# EAGLE design trx-mainboard (EAGLE 9.6.2)

## Sheet 1 of 2: Logic
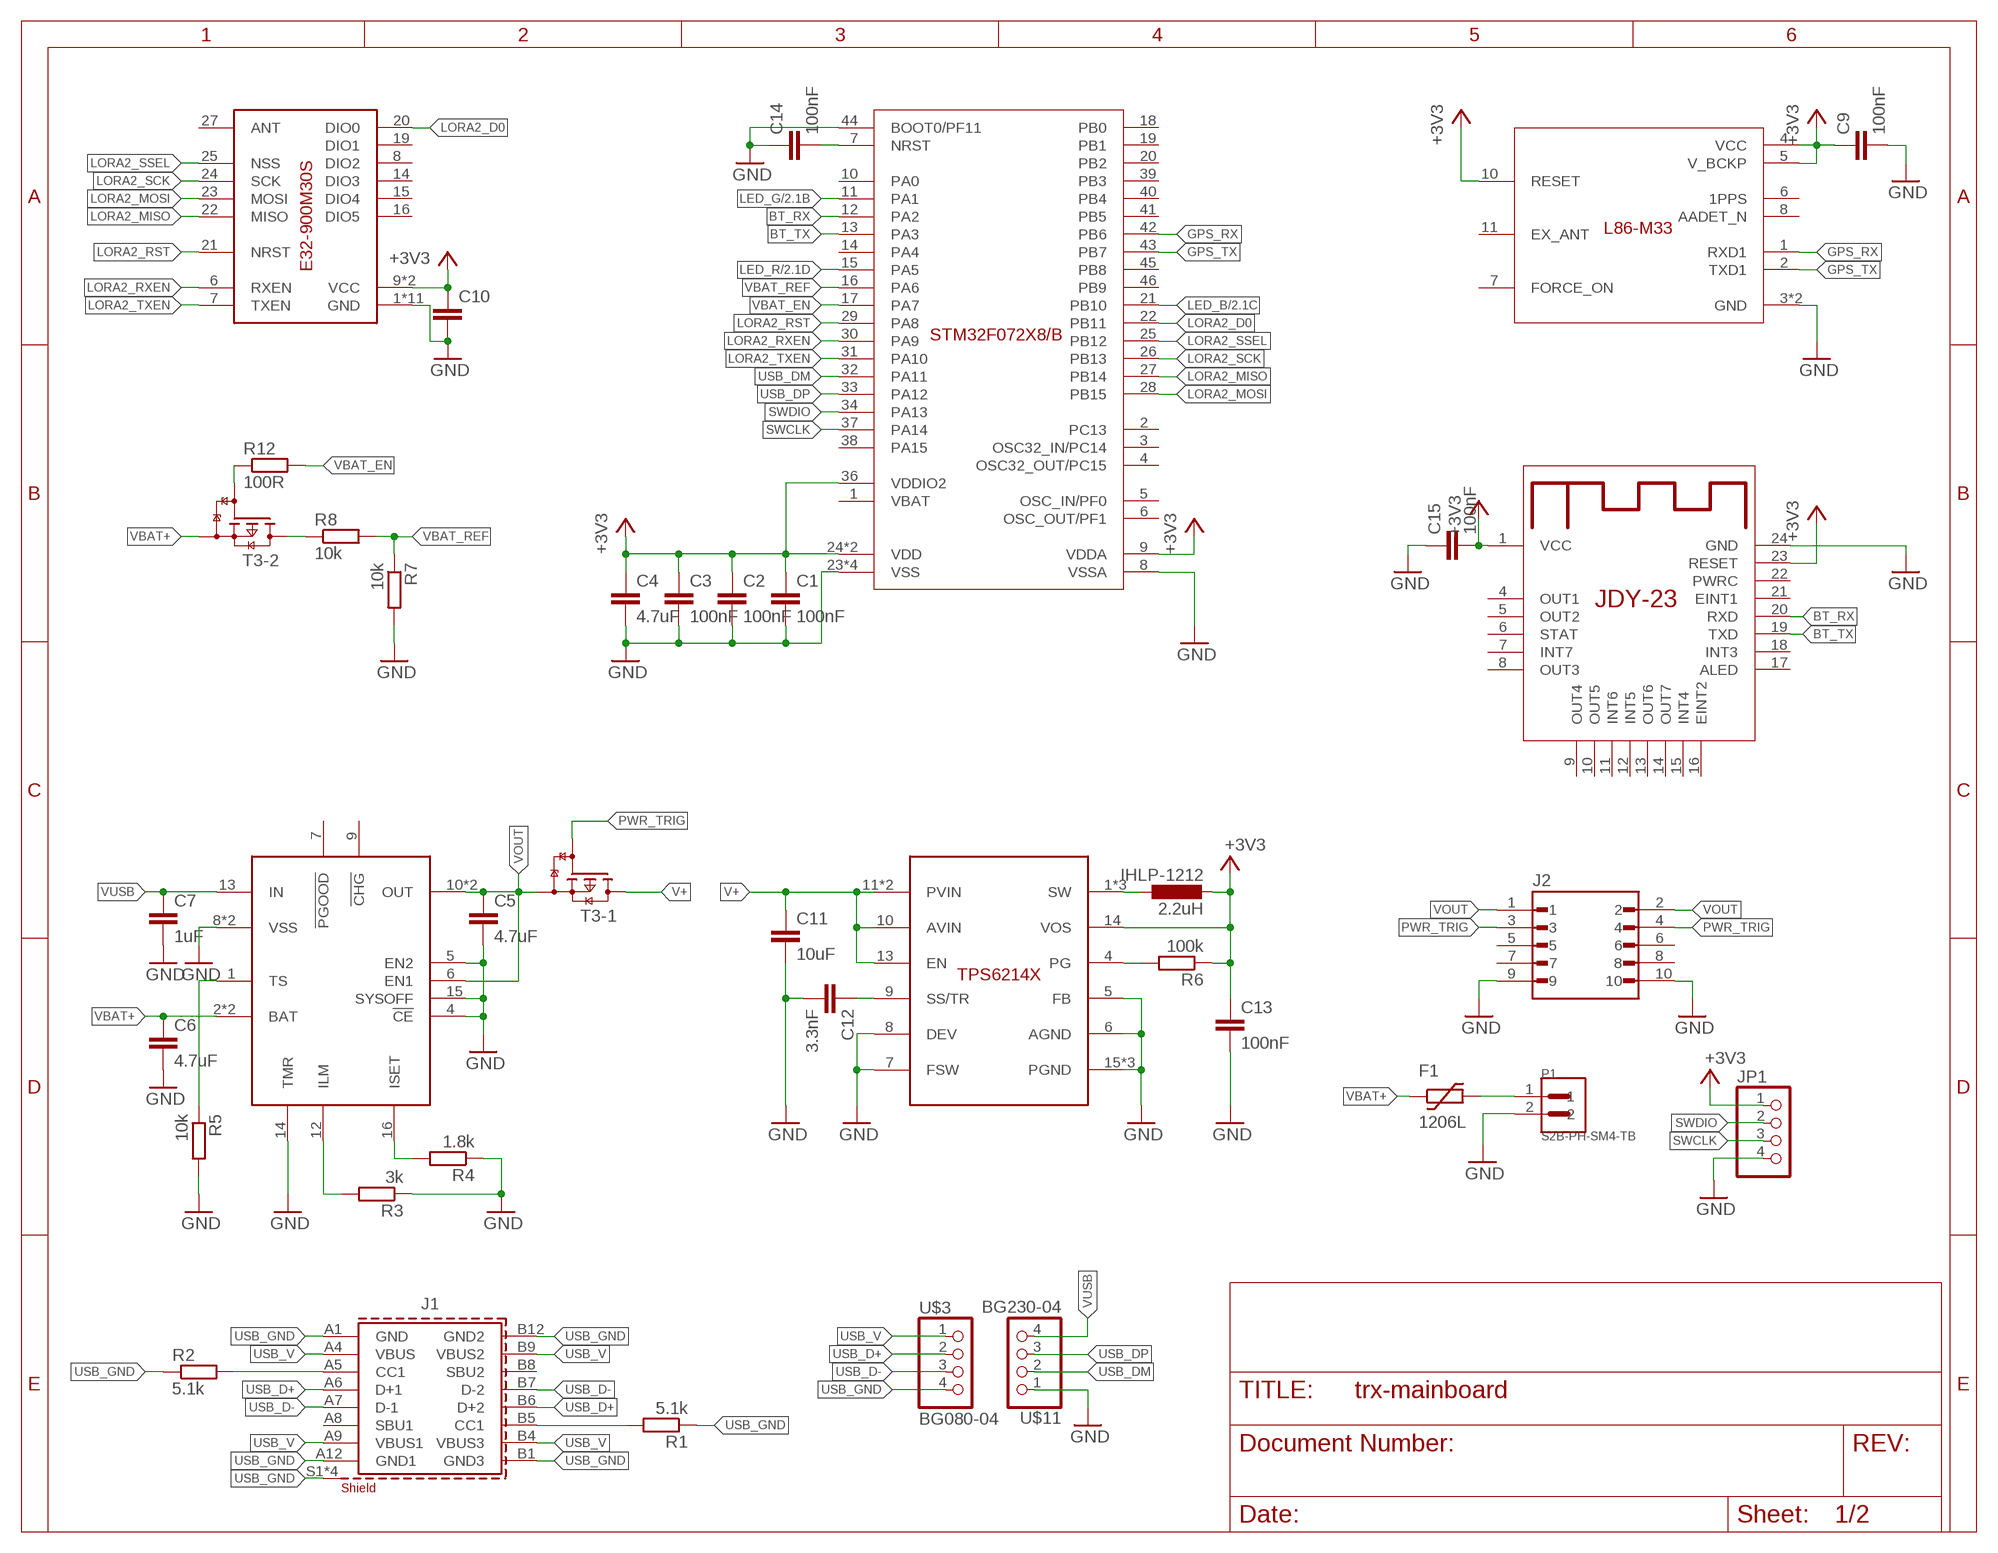
[diagram p0: schematic, sheet 1]

### Parts
C1  100nF  C-EUC0805  [C0805]
C2  100nF  C-EUC0805  [C0805]
C3  100nF  C-EUC0805  [C0805]
C4  4.7uF  C-EUC0805  [C0805]
C5  4.7uF  C-EUC0805  [C0805]
C6  4.7uF  C-EUC0805  [C0805]
C7  1uF  C-EUC0805  [C0805]
C9  100nF  C-EUC0805  [C0805]
C10  4.7uF  C-EUC0805  [C0805]
C11  10uF  C-EUC0805  [C0805]
C12  3.3nF  C-EUC0805  [C0805]
C13  100nF  C-EUC0805  [C0805]
C14  100nF  C-EUC0805  [C0805]
C15  100nF  C-EUC0805  [C0805]
F1  1206L  [1206L]
J1  629722000214  [629722000214]
J2  DF12NB(3.0)-10DP-0.5V  [HRS_DF12NB(3.0)-10DP-0.5V]
JP1  PINHD-1X04_2.54-SMD  [1X04SMD]
P1  S2B-PH-SM4-TB  [JST_S2B-PH-SM4-TB]
R1  5.1k  R-EU_R0805  [R0805]
R2  5.1k  R-EU_R0805  [R0805]
R3  3k  R-EU_R0805  [R0805]
R4  1.8k  R-EU_R0805  [R0805]
R5  10k  R-EU_R0805  [R0805]
R6  100k  R-EU_R0805  [R0805]
R7  10k  R-EU_R0805  [R0805]
R8  10k  R-EU_R0805  [R0805]
R12  100R  R-EU_R0805  [R0805]
T3  NX3008PBKS  [SOT363]
U2  BQ2407X  [VQFN16-3X3]
U$1  L86-M33  [L86-M33]
U$2  TPS6214X  [VQFN16-3X3]
U$3  BG080-04  [P-1X4/90-2.54X1.50MMX2.54MM-SMT]
U$4  IHLP-1212  [1212BZ]
U$5  JDY-23  [JDY-23]
U$10  STM32-F072X8/B-48  [UFQFPN48-7X7]
U$11  BG230-04  [S-1X4/90-2.54MM-SMT]
U$14  E32-900M30S  [E32-900M30S]

### Nets
+3V3: C1.1 C2.1 C3.1 C4.1 C9.1 C10.1 C13.1 C15.2 JP1.1 R6.1 U$1.4(VCC) U$1.5(V_BCKP) U$1.10(RESET) U$2.14(VOS) U$4.2 U$5.1(VCC) U$5.23(RESET) U$10.9(VDDA) U$10.24(VDD) U$10.36(VDDIO2) U$10.48(VDD) U$14.9(VCC) U$14.10(VCC) ; also sheet 2
BT_RX: U$5.20(RXD) U$10.12(PA2)
BT_TX: U$5.19(TXD) U$10.13(PA3)
GND: C1.2 C2.2 C3.2 C4.2 C5.2 C6.2 C7.2 C9.2 C10.2 C11.2 C12.2 C13.2 C14.1 C15.1 J2.9 J2.10 JP1.4 P1.2 R3.1 R4.1 R5.2 R7.2 U2.4(!CE) U2.5(EN2) U2.8(VSS) U2.14(TMR) U2.15(SYSOFF) U2.17(VSS) U$1.3(GND) U$1.12(GND) U$2.5(FB) U$2.6(AGND) U$2.7(FSW) U$2.8(DEV) U$2.15(PGND) U$2.16(PGND) U$2.17(PGND) U$5.24(GND) U$10.8(VSSA) U$10.23(VSS) U$10.35(VSS) U$10.44(BOOT0/PF11) U$10.47(VSS) U$10.P$49(VSS) U$11.1 U$14.1(GND) U$14.2(GND) U$14.3(GND) U$14.4(GND) U$14.5(GND) U$14.11(GND) U$14.12(GND) U$14.17(GND) U$14.18(GND) U$14.26(GND) U$14.28(GND) ; also sheet 2
GPS_RX: U$1.1(RXD1) U$10.42(PB6)
GPS_TX: U$1.2(TXD1) U$10.43(PB7)
LED_B: U$10.21(PB10) ; also sheet 2
LED_G: U$10.11(PA1) ; also sheet 2
LED_R: U$10.15(PA5) ; also sheet 2
LORA2_D0: U$10.22(PB11) U$14.20(DIO0)
LORA2_MISO: U$10.27(PB14) U$14.22(MISO)
LORA2_MOSI: U$10.28(PB15) U$14.23(MOSI)
LORA2_RST: U$10.29(PA8) U$14.21(NRST)
LORA2_RXEN: U$10.30(PA9) U$14.6(RXEN)
LORA2_SCK: U$10.26(PB13) U$14.24(SCK)
LORA2_SSEL: U$10.25(PB12) U$14.25(NSS)
LORA2_TXEN: U$10.31(PA10) U$14.7(TXEN)
N$1: J1.A5(CC1) R2.2
N$2: J1.B5(CC1) R1.2
N$3: R3.2 U2.12(ILM)
N$4: R4.2 U2.16(ISET)
N$5: R5.1 U2.1(TS)
N$6: U$2.1(SW) U$2.2(SW) U$2.3(SW) U$4.1
N$7: C12.1 U$2.9(SS/TR)
N$8: R6.2 U$2.4(PG)
N$11: C14.2 U$10.7(NRST)
N$12: F1.P$2 P1.1
N$14: R8.1 T3.3(-2:D)
N$17: R12.1 T3.5(-2:G)
PWR_TRIG: J2.3 J2.4 T3.2(-1:G)
SWCLK: JP1.3 U$10.37(PA14)
SWDIO: JP1.2 U$10.34(PA13)
USB_D+: J1.A6(D+1) J1.B6(D+2) U$3.2
USB_D-: J1.A7(D-1) J1.B7(D-2) U$3.3
USB_DM: U$10.32(PA11) U$11.2
USB_DP: U$10.33(PA12) U$11.3
USB_GND: J1.A1(GND) J1.A12(GND1) J1.B1(GND3) J1.B12(GND2) J1.S1(SHIELD) J1.S2(SHIELD) J1.S3(SHIELD) J1.S4(SHIELD) R1.1 R2.1 U$3.4
USB_V: J1.A4(VBUS) J1.A9(VBUS1) J1.B4(VBUS3) J1.B9(VBUS2) U$3.1
V+: C11.1 T3.6(-1:D) U$2.10(AVIN) U$2.11(PVIN) U$2.12(PVIN) U$2.13(EN)
VBAT+: C6.1 F1.P$1 T3.4(-2:S) U2.2(BAT) U2.3(BAT)
VBAT_EN: R12.2 U$10.17(PA7)
VBAT_REF: R7.1 R8.2 U$10.16(PA6)
VOUT: C5.1 J2.1 J2.2 T3.1(-1:S) U2.6(EN1) U2.10(OUT) U2.11(OUT)
VUSB: C7.1 U2.13(IN) U$11.4
Unconnected: J1.A8(SBU1) J1.B8(SBU2) J2.5 J2.6 J2.7 J2.8 U2.7(!PGOOD) U2.9(!CHG) U$1.6(1PPS) U$1.7(FORCE_ON) U$1.8(AADET_N) U$1.11(EX_ANT) U$5.4(OUT1) U$5.5(OUT2) U$5.6(STAT) U$5.7(INT7) U$5.8(OUT3) U$5.9(OUT4) U$5.10(OUT5) U$5.11(INT6) U$5.12(INT5) U$5.13(OUT6) U$5.14(OUT7) U$5.15(INT4) U$5.16(EINT2) U$5.17(ALED) U$5.18(INT3) U$5.21(EINT1) U$5.22(PWRC) U$10.1(VBAT) U$10.2(PC13) U$10.3(OSC32_IN/PC14) U$10.4(OSC32_OUT/PC15) U$10.5(OSC_IN/PF0) U$10.6(OSC_OUT/PF1) U$10.10(PA0) U$10.14(PA4) U$10.18(PB0) U$10.19(PB1) U$10.20(PB2) U$10.38(PA15) U$10.39(PB3) U$10.40(PB4) U$10.41(PB5) U$10.45(PB8) U$10.46(PB9) U$14.8(DIO2) U$14.14(DIO3) U$14.15(DIO4) U$14.16(DIO5) U$14.19(DIO1) U$14.27(ANT)

### Notes on the sheet
- 2.2uH

## Sheet 2 of 2
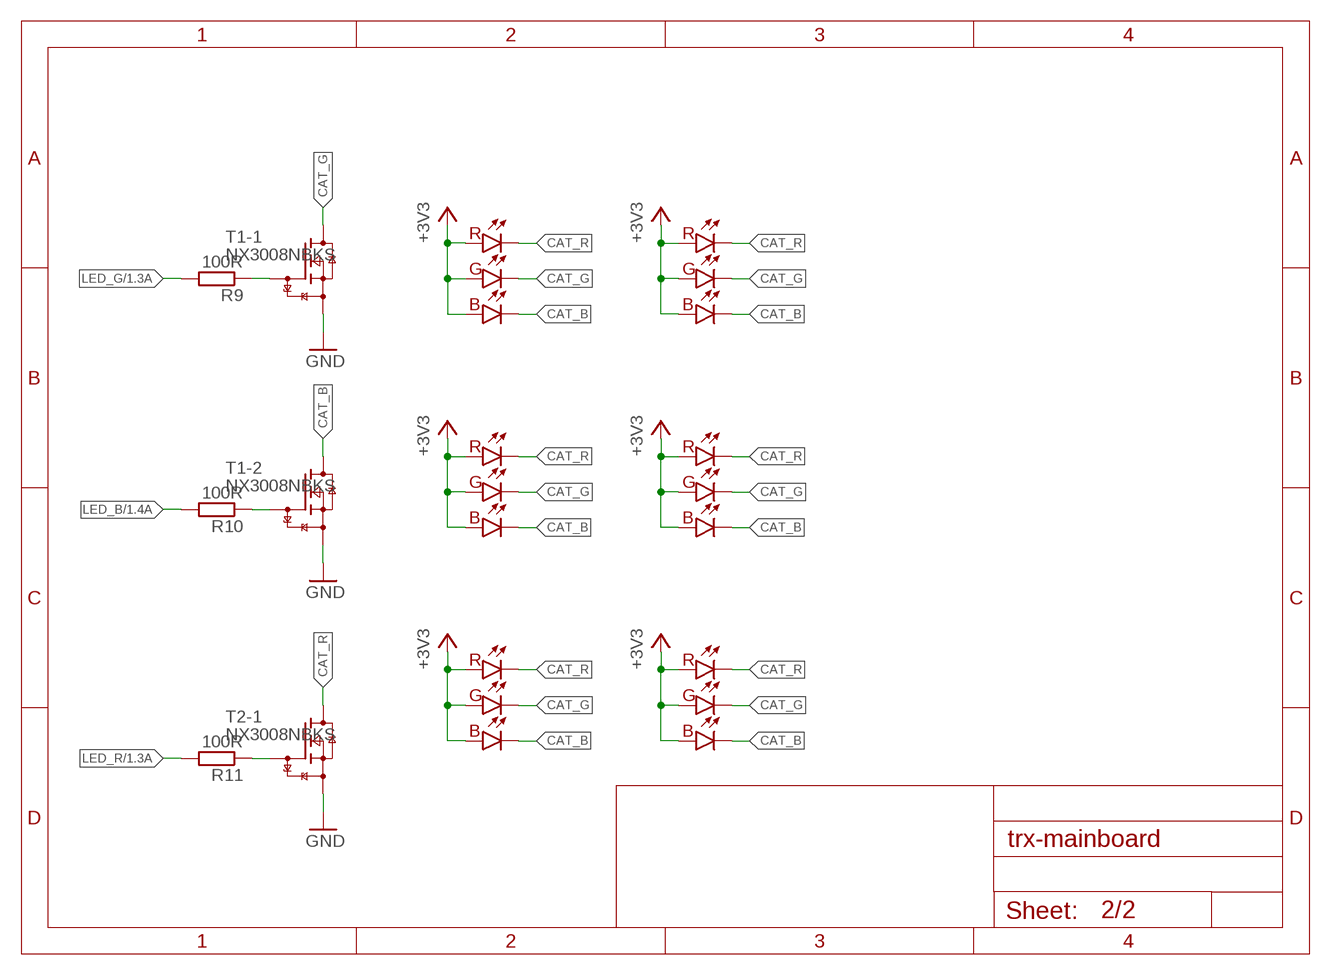
[diagram p1: schematic, sheet 2]

### Parts
R9  100R  R-EU_R0805  [R0805]
R10  100R  R-EU_R0805  [R0805]
R11  100R  R-EU_R0805  [R0805]
T1  NX3008NBKS  [SOT363]
T2  NX3008NBKS  [SOT363]
U$6  RGB_LED  [PLCC6]
U$7  RGB_LED  [PLCC6]
U$8  RGB_LED  [PLCC6]
U$9  RGB_LED  [PLCC6]
U$12  RGB_LED  [PLCC6]
U$13  RGB_LED  [PLCC6]

### Nets
+3V3: U$6.1(A.B) U$6.3(A.R) U$6.5(A.G) U$7.1(A.B) U$7.3(A.R) U$7.5(A.G) U$8.1(A.B) U$8.3(A.R) U$8.5(A.G) U$9.1(A.B) U$9.3(A.R) U$9.5(A.G) U$12.1(A.B) U$12.3(A.R) U$12.5(A.G) U$13.1(A.B) U$13.3(A.R) U$13.5(A.G) ; also sheet 1
CAT_B: T1.3(-2:D) U$6.2(C.B) U$7.2(C.B) U$8.2(C.B) U$9.2(C.B) U$12.2(C.B) U$13.2(C.B)
CAT_G: T1.6(-1:D) U$6.6(C.G) U$7.6(C.G) U$8.6(C.G) U$9.6(C.G) U$12.6(C.G) U$13.6(C.G)
CAT_R: T2.6(-1:D) U$6.4(C.R) U$7.4(C.R) U$8.4(C.R) U$9.4(C.R) U$12.4(C.R) U$13.4(C.R)
GND: T1.1(-1:S) T1.4(-2:S) T2.1(-1:S) ; also sheet 1
LED_B: R10.2 ; also sheet 1
LED_G: R9.2 ; also sheet 1
LED_R: R11.2 ; also sheet 1
N$13: R9.1 T1.2(-1:G)
N$16: R10.1 T1.5(-2:G)
N$18: R11.1 T2.2(-1:G)
Unconnected: T2.3(-2:D) T2.4(-2:S) T2.5(-2:G)

## Library data of the parts
C1-C7 C9-C15 = rcl:C-EU: CAPACITOR, European symbol; SPICEPREFIX: C
F1 = ptc-littlefuse:1206L
J1 = Wurth_Connectors_WR-USB:629722000214: WR-COM USB 2.0 Type C Plug Vertical SMT Kind Properties Durability 10 000 Mating cycles Gender Receptacle Type Horizontal General Information Operating Temperature -40 up to +85 °C Electrical Properties Working Voltage 20 V (DC) Withstanding Voltage 100 V (AC) Contact Resistance 40 mΩ Material Properties Insulator Material LCP Insulator Flammability Rating UL94 V-0 Insulator Color Black Contact Material Brass Contact Plating Gold over Nickel Contact Type Stamped Shielding Material Steel Shielding Plating Nickel (Ni) <https://www.we-online.com/catalog/media/o689297v209%20family-wr-com-629722000214.jpg> Details see: www.we-online.com/catalog/WR-COM_USB_20_TYPE_C_RECEPTACLE_HORIZONTAL_SMT Updated by Ella Wu 2022-05-09 2022 (C) Würth Elektronik; APPLICATION: USB 2.0; DATASHEET-URL: https://www.we-online.com/redexpert/spec/629722000214?ae; GERDER: Receptacle; INTERFACE-TYPE: Type C; IR: 5A; MOUNT: SMT; PACKAGING: Tape and Reel; PART-NUMBER: 629722000214; PINS: 16; TYPE: Horizontal; WORKING-VOLTAGE: 20V(AC)
J2 = con-hirose2:DF12NB(3.0)-10DP-0.5V: Check availability <https://pricing.snapeda.com/parts/DF12NB%283.0%29-10DP-0.5V%2851%29/Hirose/view-part?ref=eda>; AVAILABILITY: In Stock; DESCRIPTION: 10 Position Connector Header, Outer Shroud Contacts Surface Mount Gold; MF: Hirose; MP: DF12NB(3.0)-10DP-0.5V(51); PACKAGE: None; PRICE: None; PURCHASE-URL: https://pricing.snapeda.com/search?q=DF12NB(3.0)-10DP-0.5V(51)&ref=eda
JP1 = pinhead2:PINHD-1X04: PIN HEADER
P1 = con-jst2:S2B-PH-SM4-TB: CONN HEADER PH SIDE 2POS 2MM SMD Check availability <https://pricing.snapeda.com/parts/S2B-PH-SM4-TB/JST%20Sales/view-part?ref=eda>; AVAILABILITY: In Stock; DESCRIPTION: Connector Header Surface Mount, Right Angle 2 position 0.079 (2.00mm); MF: JST Sales; MP: S2B-PH-SM4-TB; PACKAGE: None; PRICE: None; PURCHASE-URL: https://pricing.snapeda.com/search?q=S2B-PH-SM4-TB&ref=eda
R1-R12 = rcl:R-EU_: RESISTOR, European symbol; SPICEPREFIX: R
T1 T2 = NXP_60_26022015:NX3008NBKS: 30 V, 350 mA dual N-channel Trench MOSFET Dual N-channel enhancement mode Field-Effect Transistor (FET) in a very small SOT363 (SC-88) Surface-Mounted Device (SMD) plastic package using Trench MOSFET technology. AAL Eindhoven MK
T3 = NXP_60_26022015:NX3008PBKS: 30 V, 200 mA dual P-channel Trench MOSFET Dual P-channel enhancement mode Field-Effect Transistor (FET) in a very small SOT363 (SC-88) Surface-Mounted Device (SMD) plastic package using Trench MOSFET technology. AAL Eindhoven MK
U2 = texas-instruments:BQ2407X
U$1 = quectel:L86-M33
U$2 = texas-instruments:TPS6214X
U$3 = con-gct:BG080-04
U$4 = inductor-vishay:IHLP-1212
U$5 = bluetooth:JDY-23
U$6-U$9 U$12 U$13 = led:RGB_LED
U$10 = st-microelectronics:STM32-F072X8/B-48
U$11 = con-gct:BG230-04
U$14 = ebyte:E32-900M30S

## Board
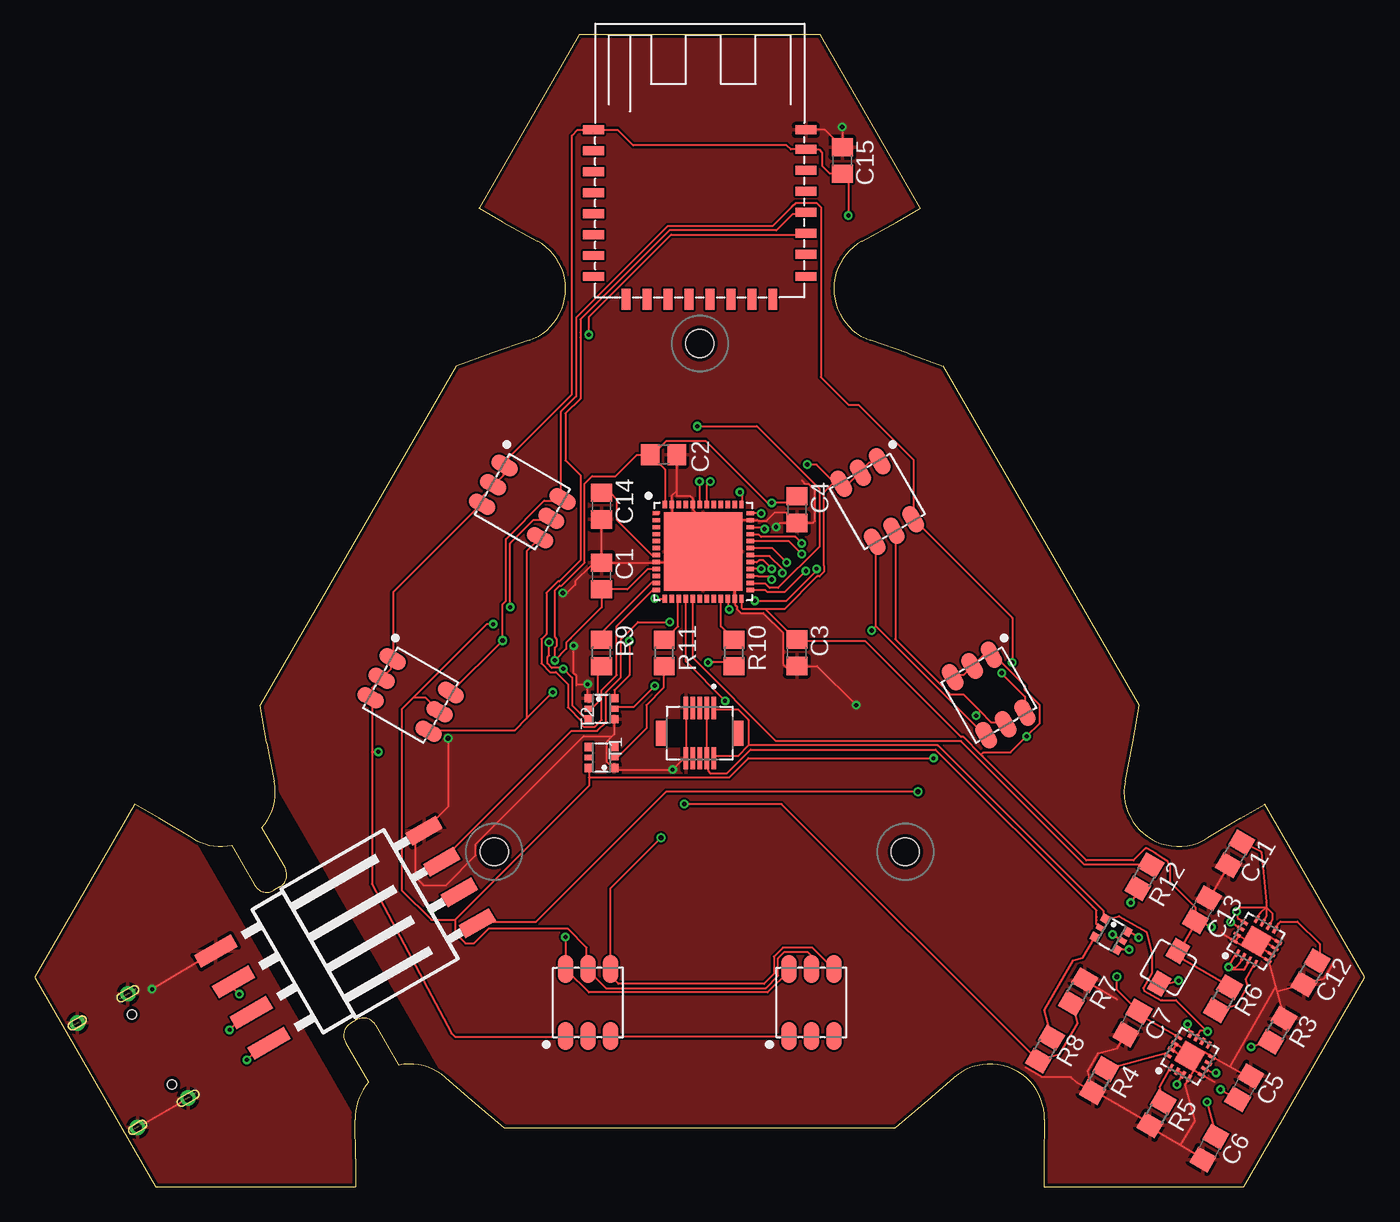
[diagram p2: board, top side]
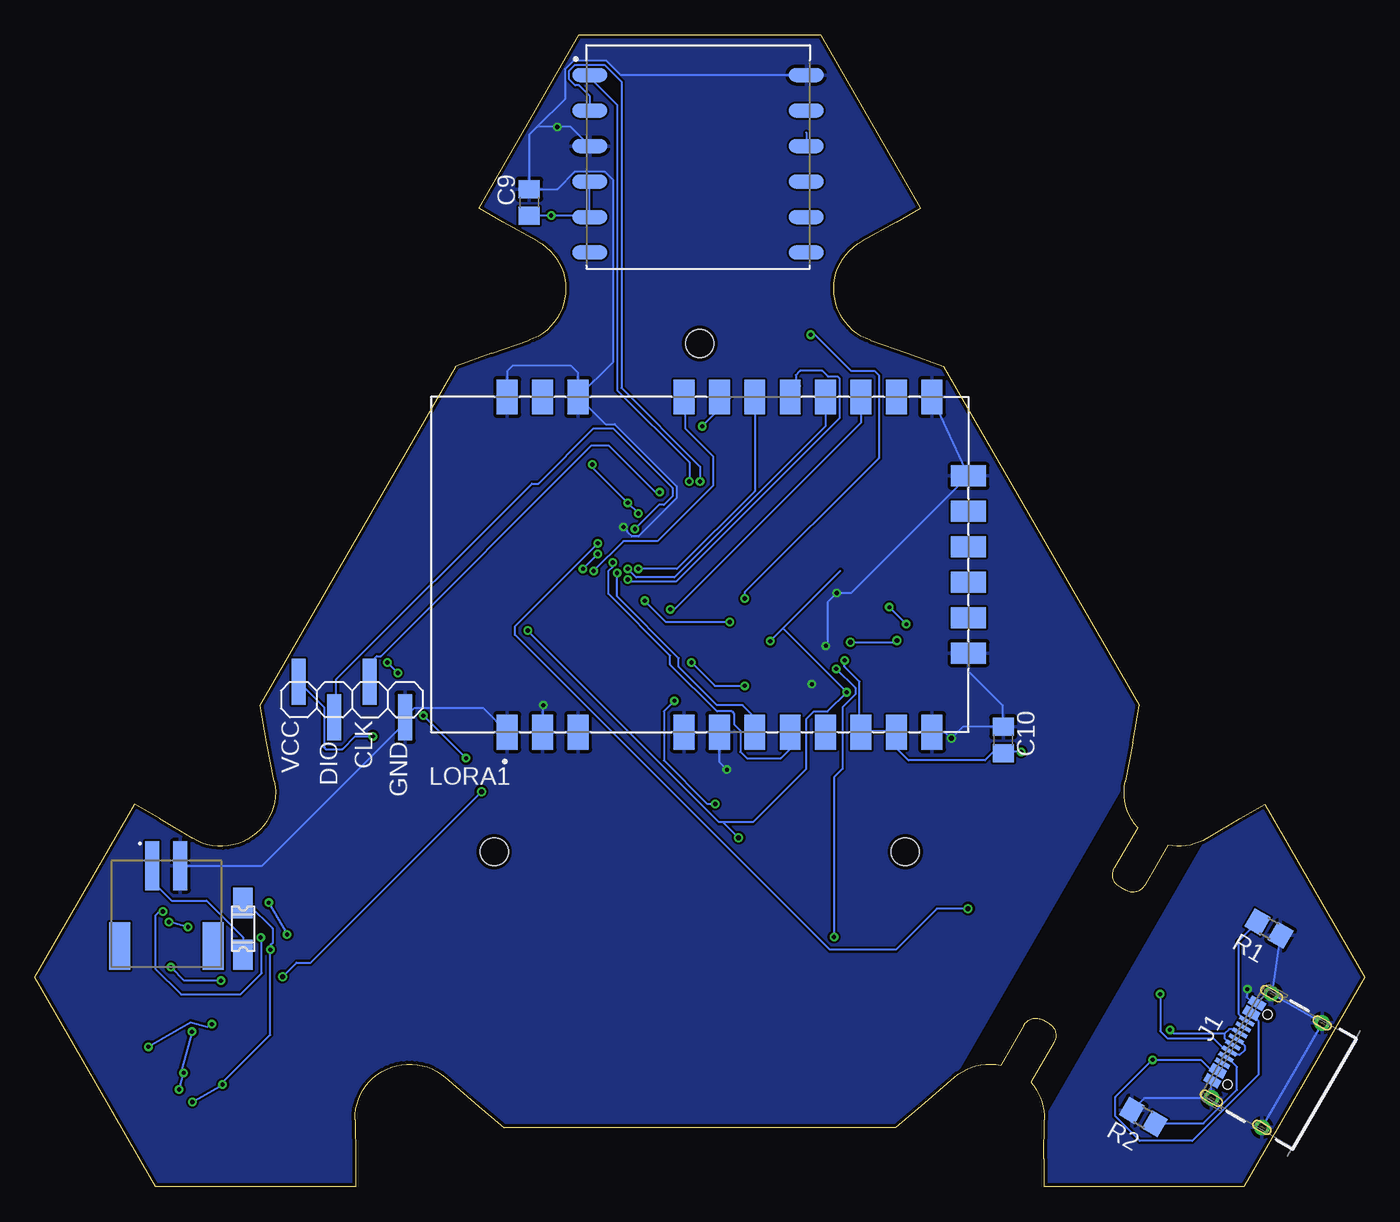
[diagram p3: board, bottom side, seen from below]

Size 95.26 x 82.5 mm. Coordinates in mm from the lower left corner, seen from the top.
Outline: 11.31,24.95 8.9,26.41 7.17,27.41 0,15 8.66,0 22.99,0 22.99,2 22.93,4.82 arc-43 23.91,7.48 22.25,10.34 arc-90 22.62,11.7 23.05,11.95 arc-90 24.42,11.59 26.07,8.72 arc-52 29.4,7.84 31.52,5.98 33.6,4.24 61.66,4.24 63.74,5.98 65.86,7.84 arc-132 72.33,4.82 72.27,2 72.27,0 86.6,0 95.26,15 88.1,27.41 86.36,26.41 83.95,24.95 arc-132 78.11,29.04 78.65,31.81 79.12,34.48 65.09,58.78 62.54,59.71 59.87,60.62 arc-132 59.25,67.73 61.73,69.09 63.46,70.09 56.29,82.5 38.97,82.5 31.81,70.09 33.54,69.09 36.01,67.73 arc-132 35.39,60.62 32.72,59.71 30.18,58.78 16.14,34.48 16.61,31.81 17.16,29.04 arc-52 16.26,25.71 17.91,22.85 arc-90 17.55,21.48 17.12,21.24 arc-90 15.75,21.6 14.1,24.46 arc-43 11.31,24.95
Copper layers (1*16): Top 0.035mm / dielectric 1.5mm / Bottom 0.035mm
Design rules "seeed-studio-2-layer (1)": minimum track width 6mil, minimum drill 12mil, track to track 6mil, track to pad 6mil, pad to pad 6mil, via to via 6mil, smd to smd 0mil, copper to edge 10mil, drill to drill 10mil, minimum pad ring 10mil, minimum via ring 6mil, stop-mask expansion 2mil, vias tented up to drill 100mil, thermal gap 10mil
Holes 2 mm at 32.91,24 62.35,24 47.63,60.4

### Footprints (pad centres in the part's own frame; a part is rotated, then mirrored left to right if it is on the bottom)
C0805 = smd 1.3 x 1.5: 1 -0.95,0; 2 0.95,0
1206L = smd 2.16 x 1.4: P$1 -1.85,0; P$2 1.85,0
629722000214 = smd 0.3 x 1.15: A1 -3.35,4.745; A4 -2.55,4.745; A5 -1.25,4.745; A6 -0.25,4.745; A7 0.25,4.745; A8 1.25,4.745; A9 2.55,4.745; A12 3.35,4.745; B1 3.05,4.745; B4 2.25,4.745; B5 1.75,4.745; B6 0.75,4.745; B7 -0.75,4.745; B8 -1.75,4.745; B9 -2.25,4.745; B12 -3.05,4.745 | drill 0.6 pad 1: S1 -4.32,4.18; S2 4.32,4.18; S3 -4.32,0; S4 4.32,0 | hole 0.65: -2.89,3.68; 2.89,3.68
HRS_DF12NB(3.0)-10DP-0.5V = smd 0.3 x 1.6: 1 -1,-1.8; 2 -1,1.8; 3 -0.5,-1.8; 4 -0.5,1.8; 5 0,-1.8; 6 0,1.8; 7 0.5,-1.8; 8 0.5,1.8; 9 1,-1.8; 10 1,1.8 | smd 0.8 x 1.8: S1 -2.75,0; S2 2.75,0
1X04SMD = smd 1.016 x 3.302: 1 -1.27,1.27; 2 1.27,-1.27; 3 3.81,1.27; 4 6.35,-1.27
JST_S2B-PH-SM4-TB = smd 1 x 3.5: 1 1,0; 2 -1,0 | smd 1.5 x 3.4: P1 3.35,5.75; P2 -3.35,5.75
R0805 = smd 1.3 x 1.5: 1 -0.95,0; 2 0.95,0
SOT363 = smd 0.6 x 0.6: 1 -0.75,-0.9; 3 0.75,-0.9; 4 0.75,0.9; 6 -0.75,0.9 | smd 0.4 x 0.6: 2 0,-0.9; 5 0,0.9
VQFN16-3X3 = smd 0.5 x 0.14: 1 -1.4,0.75; 2 -1.4,0.25; 3 -1.4,-0.25; 4 -1.4,-0.75; 9 1.4,-0.75; 10 1.4,-0.25; 11 1.4,0.25; 12 1.4,0.75 | smd 0.14 x 0.5: 5 -0.75,-1.4; 6 -0.25,-1.4; 7 0.25,-1.4; 8 0.75,-1.4; 13 0.75,1.4; 14 0.25,1.4; 15 -0.25,1.4; 16 -0.75,1.4 | smd 1.58 x 1.58: 17 0,0
L86-M33 = smd 2.5 x 1: 1 -7.75,6.35; 2 -7.75,3.81; 3 -7.75,1.27; 4 -7.75,-1.27; 5 -7.75,-3.81; 6 -7.75,-6.35; 7 7.75,-6.35; 8 7.75,-3.81; 9 7.75,-1.27; 10 7.75,1.27; 11 7.75,3.81; 12 7.75,6.35
P-1X4/90-2.54X1.50MMX2.54MM-SMT = smd 1.02 x 3: 1 -3.81,5; 2 -1.27,5; 3 1.27,5; 4 3.81,5
1212BZ = smd 1.5 x 1.2: 1 -1.35,0; 2 1.35,0
JDY-23 = smd 0.635 x 1.5: 1 2.2,7.6; 2 0.7,7.6; 3 -0.8,7.6; 4 -2.3,7.6; 5 -3.8,7.6; 6 -5.3,7.6; 7 -6.8,7.6; 8 -8.3,7.6; 17 -8.3,-7.6; 18 -6.7,-7.6; 19 -5.2,-7.6; 20 -3.7,-7.6; 21 -2.2,-7.6; 22 -0.7,-7.6; 23 0.8,-7.6; 24 2.2,-7.6 | smd 1.5 x 0.635: 9 -9.93,5.27; 10 -9.93,3.77; 11 -9.93,2.27; 12 -9.93,0.77; 13 -9.93,-0.73; 14 -9.93,-2.23; 15 -9.93,-3.73; 16 -9.93,-5.23
PLCC6 = smd 2 x 1.1: 1 -2.4,1.6; 2 2.4,1.6; 3 -2.4,0; 4 2.4,0; 5 -2.4,-1.6; 6 2.4,-1.6
UFQFPN48-7X7 = smd 0.4 x 0.2: 1 -3.375,2.75 | smd 0.55 x 0.3: 2 -3.375,2.25; 3 -3.375,1.75; 4 -3.375,1.25; 5 -3.375,0.75; 6 -3.375,0.25; 7 -3.375,-0.25; 8 -3.375,-0.75; 9 -3.375,-1.25; 10 -3.375,-1.75; 11 -3.375,-2.25; 12 -3.375,-2.75; 25 3.375,-2.75; 26 3.375,-2.25; 27 3.375,-1.75; 28 3.375,-1.25; 29 3.375,-0.75; 30 3.375,-0.25; 31 3.375,0.25; 32 3.375,0.75; 33 3.375,1.25; 34 3.375,1.75; 35 3.375,2.25; 36 3.375,2.75 | smd 0.3 x 0.55: 13 -2.75,-3.375; 14 -2.25,-3.375; 15 -1.75,-3.375; 16 -1.25,-3.375; 17 -0.75,-3.375; 18 -0.25,-3.375; 19 0.25,-3.375; 20 0.75,-3.375; 21 1.25,-3.375; 22 1.75,-3.375; 23 2.25,-3.375; 24 2.75,-3.375; 37 2.75,3.375; 38 2.25,3.375; 39 1.75,3.375; 40 1.25,3.375; 41 0.75,3.375; 42 0.25,3.375; 43 -0.25,3.375; 44 -0.75,3.375; 45 -1.25,3.375; 46 -1.75,3.375; 47 -2.25,3.375; 48 -2.75,3.375 | smd 5.6 x 5.6: P$49 0,0
S-1X4/90-2.54MM-SMT = smd 1.04 x 2.5: 1 -3.81,2.45; 2 -1.27,2.45; 3 1.27,2.45; 4 3.81,2.45
E32-900M30S = smd 2.5 x 1.5: 1 12,-13.79; 2 12,-11.25; 3 12,-8.71; 4 12,-1.14; 5 12,1.4; 6 12,3.94; 7 12,6.48; 8 12,9.02; 9 12,11.56; 10 12,14.1; 11 12,16.64; 18 -12,16.64; 19 -12,14.1; 20 -12,11.56; 21 -12,9.02; 22 -12,6.48; 23 -12,3.94; 24 -12,1.4; 25 -12,-1.14; 26 -12,-8.71; 27 -12,-11.25; 28 -12,-13.79 | smd 1.5 x 2.5: 12 6.35,19.254; 13 3.81,19.254; 14 1.27,19.254; 15 -1.27,19.254; 16 -3.81,19.254; 17 -6.35,19.254

### Placement (x,y rotation side)
C1  40.6,43.75 90 top
C2  45.04,52.44 0 top
C3  54.59,38.25 270 top
C4  54.6,48.5 270 top
C5  86.64,7.11 60 top
C6  84.14,2.78 240 top
C7  78.63,11.73 240 top
C9  59.85,70.5 90 bottom
C10  25.88,32 90 bottom
C11  85.99,23.86 240 top
C12  91.39,15.33 240 top
C13  83.6,19.84 60 top
C14  40.6,48.75 90 top
C15  57.85,73.5 270 top
F1  80.35,18.48 270 bottom
J1  5.2,8 60 bottom
J2  47.63,32.5 180 top
JP1  75.09,34.9 0 bottom
P1  85.85,23 180 bottom
R1  6.85,18.5 150 bottom
R2  15.85,5 330 bottom
R3  89.01,11.22 240 top
R4  76.25,7.62 60 top
R5  80.37,5.24 240 top
R6  85.12,13.47 240 top
R7  74.73,13.98 60 top
R8  72.36,9.86 240 top
R9  40.59,38.24 90 top
R10  50.09,38.24 90 top
R11  45.09,38.24 90 top
R12  79.48,22.21 60 top
T1  40.6,34.24 270 top
T2  40.6,30.74 90 top
T3  77.11,18.09 240 top
U2  82.74,9.36 60 top
U$1  47.75,73.27 0 bottom
U$2  87.49,17.58 60 top
U$3  19.2,16.09 120 top
U$4  81.22,15.72 60 top
U$5  47.63,73.5 90 top
U$6  26.92,35.22 330 top
U$7  34.92,49.08 330 top
U$8  39.63,13.2 90 top
U$9  55.63,13.2 90 top
U$10  47.88,45.5 0 top
U$11  27.66,20.97 300 top
U$12  60.35,49.08 300 top
U$13  68.35,35.22 300 top
U$14  47.63,44.57 270 bottom

### Tracks (layer width: path | path; a pad name or v marks a point on that pad's centre or on a via)
+3V3  (via drill 0.3)  (1 unrouted)
  Top 0.152: v85.65,18.97 86.41,18.53 U$2.14 | v84.29,18.61 83.42,19.11 83.25,19.06 C13.1 | C13.1 83.19,18.95 82,16.89 U$4.2 81.94,16.79 82.03,16.44 85.6,14.38 R6.1 | C13.1 83.12,19.12 83.12,20.03 81.29,21.86 81.29,23.08 81.17,23.2 81.13,23.37 80.84,23.53 80.31,23.89 79.67,24.25 79.57,24.25 78.71,23.38 75.32,23.38 67.88,30.82 67.88,30.85 67.79,30.94 | U$12.5 57.82,50.36 58.28,50.36 59.04,51.12 U$12.3 59.2,51.27 59.81,51.88 60.42,51.88 U$12.1 | v52.03,48.23 51.27,48.23 U$10.36 | C4.1 54.47,49.44 54.01,48.99 v52.8,48.99 52.49,48.99 48.06,53.42 45.24,53.42 44.26,52.44 C2.1 | 44.11,52.34 C2.1 | v55.33,51.73 56,51.73 57.37,50.36 57.67,50.36 U$12.5 | 50.66,41.98 U$10.24 50.63,41.46 50.7,41.4 52.31,41.4 52.33,41.38 | U$13.5 65.9,36.64 66.51,36.64 67.12,37.25 U$13.3 67.27,37.41 67.88,38.01 68.49,38.01 U$13.1 68.64,38.17 70.93,35.88 70.93,35.55 71.99,34.49 71.99,33.21 v71.05,32.27 69.9,31.12 67.96,31.12 67.79,30.94 | 67.79,30.94 66.51,32.22 66.36,32.22 59.5,39.08 54.62,39.08 C3.1 54.47,39.23 52.33,41.38 | 44.41,44.26 U$10.9 43.9,44.25 42.45,42.8 C1.1 40.6,41.5 38.38,39.28 38.37,39.28 38.06,38.97 38.06,38.52 v37.25,37.71 37.25,38.62 37.4,38.77 37.4,39.23 37.25,39.38 37.25,42.72 37.59,43.07 37.74,43.07 39.39,44.71 39.39,50.36 39.93,50.9 41.61,50.9 43.09,52.39 44.04,52.39 C2.1 | U$5.1 39.99,75.67 39.99,75.5 | v58.28,69.56 58.28,72.15 57.98,72.46 C15.2 57.82,72.61 56.92,72.61 56.4,73.14 56.4,74.06 56.16,74.3 U$5.23 54.15,74.3 53.86,74.59 42.86,74.59 41.75,75.7 U$5.1 | 38.16,10.73 39.54,10.73 U$8.3 39.69,10.73 41.21,10.73 U$8.5 41.37,10.73 54.01,10.73 U$9.1 54.17,10.73 55.54,10.73 U$9.3 55.69,10.73 57.21,10.73 U$9.5
  Top 0.152: 38.16,10.73 U$8.1 38.01,10.89 | 24.14,31.16 24.14,34.97 U$6.5 24.14,35.12 24.14,35.73 24.75,36.34 U$6.3 24.91,36.49 25.52,37.1 25.52,37.71 U$6.1 25.67,37.86 25.67,42.59 31.92,48.84 U$7.5 32.07,48.99 32.07,49.44 32.83,50.21 U$7.3 32.98,50.36 33.59,50.97 33.59,51.58 U$7.1 33.75,51.73 33.75,52.03 38.47,56.76 38.47,75.29 38.88,75.7 U$5.1 | 24.14,31.16 24.14,21.69 29.85,11 30.11,10.73 38.16,10.73 | 24.14,31.16 v24.6,31.16 | 43.96,52.34 C2.1 | C2.1 45.13,51.39 U$10.48 | 57.67,50.21 U$12.5 | U$12.5 57.15,50.36 56.5,49.7 56.5,44.52 56.53,44.48 56.53,44.04 56.22,43.73 56.05,43.73 53.7,41.38 52.33,41.38
  Bottom 0.152: v84.29,18.61 v85.65,18.97 | v52.03,48.23 v52.8,48.99 55.33,51.52 v55.33,51.73 | 76.26,36.28 JP1.1 74.56,34.37 74.56,31.48 74.42,31.35 73.22,31.35 72.3,32.27 v71.05,32.27 | v37.25,37.71 37.25,37.25 36.18,36.19 36.18,32.61 | 36.18,32.61 U$14.9 | 55.54,69.56 v58.28,69.56 59.81,69.56 C9.1 | 55.54,69.56 55.54,71.85 U$1.4 | 55.54,69.56 U$1.5 | 39.99,75.5 39.99,74.59 U$1.10 | v24.6,31.16 25.82,31.16 C10.1 25.97,31.16 26.58,31.16 27.19,30.55 32.68,30.55 33.44,31.31 33.44,32.53 U$14.10 33.59,32.68 33.59,32.61 | 33.44,32.46 33.59,32.61 | 33.59,32.61 36.18,32.61
BT_RX
  Top 0.152: U$10.12 44.41,42.74 44.26,42.74 41.67,40.15 41.67,36.64 40.6,35.58 40.6,33.44 40.12,32.96 39.3,32.96 39.17,33.09 39.17,33.36 38.19,34.34 38.19,36.01 37.33,36.87 36.9,36.87 36.29,37.48 36.29,39.23 36.64,39.58 36.64,42.55 37.47,43.37 37.58,43.37 39.08,44.87 39.08,50.97 38.01,52.03 38.01,55.39 39.08,56.45 39.08,60.83 39.08,61.18 39.08,62.12 45.45,68.49 53.12,68.49 54.32,69.69 55.12,69.69 U$5.20 | 55.08,69.8 U$5.20 | 55.08,69.71 U$5.20
BT_TX  (via drill 0.3)
  Top 0.152: v44.41,42.13 45.02,42.13 U$10.13 | U$5.19 55.08,68.19 45.58,68.19 39.69,62.3 v39.69,61.03
  Bottom 0.152: v44.41,42.13 44.41,42.59 34.81,52.19 34.81,58.13 35.12,58.44 36.79,58.44 39.38,61.03 v39.69,61.03
CAT_B  (via drill 0.3, 0.35)
  Top 0.152: U$9.2 54.01,15.46 52.49,13.94 39.69,13.94 38.16,15.46 U$8.2 38.01,15.61 v38.01,17.9 | v37.86,37.1 38.01,36.95 | T1.3 39.69,33.59 39.38,33.59 38.49,34.49 38.49,36.47 v37.86,37.1 | 29.94,35.42 U$6.2 v33.52,39.13 33.52,41.74 33.75,41.97 33.75,46.4 36.49,49.14 37.71,49.14 U$7.2 37.71,49.29 37.71,55.54 38.77,56.61 38.77,61.29 38.77,61.37 38.77,62.25 45.32,68.8 52.85,68.8 54.25,70.21 54.52,70.48 56,70.48 56.3,70.17 56.3,58 58.3,56 59.01,56 62.93,52.08 U$12.2 | 62.85,47.92 U$12.2 | U$12.2 63.01,47.77 70.02,40.76 v70.02,37.56 | v69.25,36.8 70.93,35.12 70.93,34.05 U$13.2 | v37.86,37.1 37.78,37.18 37.03,37.18 36.72,37.49 36.72,37.93 36.85,38.06 v36.85,39
  Bottom 0.152: v37.86,37.1 36.49,35.73 36.49,35.27 37.4,34.36 37.4,29.94 38.01,29.33 v38.01,17.9 | v70.02,37.56 v69.25,36.8 | v36.85,39 33.64,39 v33.52,39.13
CAT_G  (via drill 0.3, 0.35)
  Top 0.152: 60.26,40.15 60.26,46.09 U$12.6 | 60.26,40.15 68.04,32.38 U$13.6 | 41.37,15.61 U$8.6 | U$9.6 57.21,15.61 55.69,17.14 53.58,17.14 52.95,16.5 52.95,15.25 52.24,14.54 41.81,14.54 41.23,15.12 U$8.6 | v42.58,39.08 42.58,36.64 41.52,35.58 41.52,35.12 T1.6 | 36.34,46.4 U$7.6 35.24,45.53 35.24,33.56 | v37.1,35.42 35.24,33.56 | U$6.6 28.26,32.68 34.35,32.68 35.24,33.56 | v59.96,39.84 60.26,40.15 | U$8.6 41.23,21.39 v44.85,25
  Bottom 0.152: 37.56,44.11 41.67,40 | 41.67,40 v42.58,39.08 | 41.67,40 v37.1,35.42 38.47,34.05 39.46,34.05 39.99,33.51 39.99,29.94 43.8,26.13 45.97,26.13 | v59.96,39.84 46.24,26.13 45.97,26.13 | v44.85,25 45.97,26.13
CAT_R  (via drill 0.3)
  Top 0.152: 67.73,34.05 66.51,35.27 65.6,35.27 61.63,39.23 61.63,46.85 U$12.4 | 67.73,34.05 68.49,33.29 69.41,33.29 U$13.4 | 39.69,29.33 39.69,29.94 T2.6 | U$6.4 28.87,33.9 28.56,33.9 U$6.4 | v34.05,41.52 34.05,46.09 35.73,47.77 36.95,47.77 U$7.4 | 55.54,15.61 U$9.4 55.63,15.03 55.65,15.02 55.65,16.55 55.37,16.83 53.71,16.83 53.25,16.37 53.25,15.13 52.36,14.24 40.91,14.24 39.69,15.46 U$8.4 39.54,15.61 39.54,17.14 38.16,18.51 32.53,18.51 31.46,17.44 30.85,17.44 30.09,18.2 30.09,19.12 | v67.43,33.75 67.73,34.05 | v64.38,30.7 51.12,30.7 49.75,29.33 39.69,29.33 | U$6.4 28.67,33.7 | 30.09,19.12 39.69,28.72 39.69,29.33 | 30.09,19.12 28.41,19.12 26.28,21.25 26.28,34.21 27.09,35.02 | U$6.4 28,35.02 27.09,35.02 | v32.83,40.3 32.37,40.3 27.09,35.02
  Bottom 0.152: v32.83,40.3 v34.05,41.52 | v64.38,30.7 v67.43,33.75
GND  (via drill 0.3, 0.35)
  Top 0.152: U2.15 81.52,9.81 81.77,10.24 U2.14 83.31,9.31 | 81.41,9.87 U2.15 | 78.28,10.96 C7.2 | 77.53,13.41 75.26,14.72 R7.2 | 78.17,11.02 C7.2 | R4.1 75.91,6.84 79.91,4.53 R5.2 79.96,4.36 80,4.19 82.06,3 | 82.06,3 83.68,2.06 C6.2 | 75.55,7.85 75.8,6.91 R4.1 | 75.55,7.85 75.43,8.27 76.18,9.57 77.55,9.94 78.11,10.91 C7.2 | U$2.16 86.02,17.61 86.27,18.04 U$2.15 87.41,17.35 | 85.04,18.17 85.91,17.67 U$2.16 | 84.45,20.39 84.12,20.57 C13.2 84.19,20.68 85.5,22.96 C11.2 85.45,23.13 | 82.69,7.84 U2.4 | 83.54,8.06 U2.5 | 86.56,8.05 86.89,7.86 87.06,7.91 C5.2 86.56,8.05 | 86.56,8.05 85.59,8.61 | 85.59,8.61 84.4,9.3 U2.8 83.79,9.63 82.88,9.56 | 84.51,7.5 83.65,8 U2.5 | 88.65,16.66 88.4,16.23 | 88.9,17.1 88.65,16.66 | 88.65,16.66 U$2.6 87.73,17.16 | 88.9,17.1 89.15,17.53 U$2.8 87.92,18.23 87.41,17.35 | 88.9,17.1 U$2.7 88.19,17.5 87.52,17.55 | 88.99,14.01 89.5,12.13 R3.1 | 88.99,14.01 88.9,14.35 | 88.9,14.35 88.4,16.23 | 88.4,16.23 U$2.5 87.24,16.83 87.26,16.88 | 88.99,14.01 90.87,14.51 C12.2 91.04,14.56 92.41,14.93 93.16,16.22 | 88.9,14.35 85.59,8.61 | 47.16,48.84 U$10.44 | 86.02,17.59 U$2.16 | C1.2 44.46,44.7 U$10.8 49.83,44.75 50.17,44.41 | C1.2 C14.1 | 45.99,49.86 45.99,49.48 46.94,49.48 47.13,49.28 U$10.44 | 45.99,49.86 C2.2 | 45.99,49.86 45.62,49.49 45.62,48.88 U$10.47 45.63,47.47 46.25,46.86 48.9,46.86 | C4.2 53.84,48.3 53.03,48.3 52.42,47.69 51.81,47.69 51.75,47.75 U$10.35 49.8,47.75 48.9,46.86 | 50.17,42.09 U$10.23 50.13,42.91 49.78,43.25 47.85,43.25 | 50.17,42.09 50.17,41.7 50.29,41.58 50.29,41.37 50.57,41.09 52.18,41.09 53.61,39.67 53.61,37.44 53.85,37.2 54.49,37.2 C3.2 56.05,37.3 v58.85,34.5 | 75.5,7.84 75.55,7.85
  Top 0.152: J2.9 46.63,30.83 | 46.63,30.83 J2.10 | 46.63,30.83 v45.69,29.88 41.75,29.88 41.57,30.06 41.52,30.09 T2.1 41.17,30.31 41.1,30.31 40.97,30.45 40.97,31.88 41.36,32.28 | T1.4 41.5,32.41 41.36,32.28 | C1.2 40.4,44.5 39.85,44.5 38.71,43.36 38.71,43.1 38.14,42.53 v37.81,42.53 | T1.1 39.6,35.09 v39.6,36 38.8,36 | R4.1 74.6,7.5 74.24,7.86 72.12,7.86 72.05,7.93 70.98,8.55 | v53.1,47.25 53.4,47.55 C4.2 | v57.84,75.91 v57.85,75.9 C15.1 56.6,75.7 U$5.24 | C4.2 55.75,47.55 55.89,47.69 55.89,49.88 55.44,50.33 55.22,50.33 54.96,50.59 | 47.88,43.29 47.85,43.25 | 47.85,43.25 47.6,43 | 47.78,44.75 47.84,44.81 | 47.88,45.95 47.84,46 | 47.84,46.23 47.88,46.18 | U$10.44 47.13,48.51 48.84,46.8 48.9,46.86 | 50.17,44.41 50.17,45.59 48.9,46.86 | 50.17,44.41 50.17,42.09 | 87.41,17.35 87.73,17.16 | 87.73,17.16 87.84,17.1 87.58,17.46 | 87.58,17.46 87.52,17.55 | 87.52,17.55 U$2.17 | 82.88,9.56 U2.17 | U2.5 83.04,8.34 | 83.04,8.34 82.56,8.63 82.7,9.06 | 82.7,9.06 82.88,9.56 | U2.4 83.04,8.34 | U2.4 82.4,7.3 83.1,4.75 82.06,3 | 87.26,16.88 87.58,17.46 | v38.6,38.75 38.6,36.8 38.8,36.6 38.8,36 | 38.8,35.92 38.8,36 | U$2.16 87.26,16.88 | U2.15 82.7,9.06 | 41.36,32.28 39.31,32.28 31.58,24.55 31.58,23.73 29.45,21.6 27.85,21.6 27.25,22.2 27.25,24.86 U$11.1 29.61,27.23 v29.61,32.12
  Bottom 0.152: P1.2 78.97,23 68.74,33.23 JP1.4 | v58.85,34.5 58.88,34.46 U$14.2 | U$14.2 U$14.3 | U$14.2 U$14.1 63.13,34.28 68.09,34.28 JP1.4 | 68.7,33.63 JP1.4 | U$14.4 U$14.5 46.23,30.43 v45.69,29.88 | 25.96,32.87 25.94,32.89 | 25.94,32.89 C10.2 | C10.2 25.68,32.75 | v38.6,38.75 38.47,38.62 38.47,41.88 v37.81,42.53 36.77,42.53 U$14.17 U$14.18 | U$14.26 54.4,54.63 53.74,54.63 49.29,50.18 49.29,49.32 52.02,46.59 52.49,46.59 52.81,46.9 52.81,46.96 v53.1,47.25 | U$14.26 53.86,59.05 53.86,72.14 54.45,72.73 56.55,72.73 57.83,71.45 C9.2 59.85,75.34 59.28,75.91 | U$14.26 56.82,57.05 | 61.33,57.05 61.47,56.91 61.47,56.61 U$14.28 61.42,58.42 61.05,58.8 56.85,58.8 56.34,58.3 U$14.26 | U$1.12 53.29,79.62 54.32,80.65 56.68,80.65 57.28,80.05 57.28,77.9 59.28,75.91 | U$1.3 56.87,75.91 v57.84,75.91 59.28,75.91 | U$14.11 30.05,32.57 v29.61,32.12 28.78,32.95 C10.2 | U$14.12 28.38,36.93 25.94,34.49 25.94,32.89
  pour Top: 38.97,82.5 56.29,82.5 63.46,70.09 59.25,67.73 arc135 59.87,60.62 65.09,58.78 79.12,34.48 78.11,29.04 arc135 83.95,24.95 88.1,27.41 95.26,15 86.6,0 72.27,0 72.33,4.82 arc135 65.86,7.84 61.66,4.24 33.6,4.24 29.4,7.84 17.16,29.04 16.14,34.48 30.18,58.78 35.39,60.62 arc135 36.01,67.73 31.81,70.09
  pour Bottom: 38.97,82.5 56.29,82.5 63.46,70.09 59.25,67.73 arc135 59.87,60.62 65.09,58.78 79.12,34.48 78.11,29.04 arc135 83.95,24.95 88.1,27.41 95.26,15 86.6,0 72.27,0 72.33,4.82 arc135 65.86,7.84 61.66,4.24 33.6,4.24 29.4,7.84 17.16,29.04 16.14,34.48 30.18,58.78 35.39,60.62 arc135 36.01,67.73 31.81,70.09
GPS_RX  (via drill 0.3)
  Top 0.152: U$10.42 48.12,48.88 48.12,50.26 v48.38,50.51
  Bottom 0.152: v48.38,50.51 48.38,51.88 53.56,57.06 53.56,77.49 55.54,79.47 U$1.1
GPS_TX  (via drill 0.3)
  Top 0.152: v47.61,50.51 47.61,48.99 U$10.43
  Bottom 0.152: v47.61,50.51 47.61,51.58 53.25,57.22 53.25,79.15 54.45,80.35 56.55,80.35 56.98,79.92 56.98,79.32 56.55,78.89 56.29,78.89 55.5,78.1 U$1.2 55.54,77.18
LED_B
  Top 0.152: U$10.21 49.14,41.98 49.14,40.15 50.05,39.23 R10.2
LED_G
  Top 0.152: U$10.11 44.17,43.26 40.6,39.69 40.6,39.23 R9.2
LED_R
  Top 0.152: U$10.15 46.09,41.98 46.09,40.15 45.18,39.23 R11.2
LORA2_D0  (via drill 0.3)
  Top 0.152: v49.75,41.37 49.64,41.48 U$10.22
  Bottom 0.152: v49.75,41.37 49.44,41.37 36.07,54.74 U$14.20 36.18,56.54
LORA2_MISO  (via drill 0.3)
  Top 0.152: U$10.27 51.79,43.75 51.81,43.73 52.57,43.73 v52.8,43.5
  Bottom 0.152: v52.8,43.5 52.64,43.35 49.32,43.35 37.63,55.03 37.63,57.91 | 40.45,57.37 41.06,56.76 41.06,56.69 U$14.22 40.45,57.37 | 40.45,57.37 40.76,57.67 40.76,58.13 40.45,58.44 38.85,58.44 38.46,58.05 37.77,58.05 37.63,57.91 | 37.63,57.91
LORA2_MOSI  (via drill 0.3)
  Top 0.152: v52.03,44.26 51.27,44.26 U$10.28
  Bottom 0.152: U$14.23 43.69,49.84 49.26,44.26 v52.03,44.26
LORA2_RST  (via drill 0.3)
  Top 0.152: v52.8,44.26 52.19,44.87 51.88,44.87 51.73,44.72 51.27,44.72 U$10.29
  Bottom 0.152: v52.8,44.26 52.19,43.65 49.44,43.65 38.62,54.47 38.62,56.54 U$14.21
LORA2_RXEN  (via drill 0.3)
  Top 0.152: v53.56,43.96 53.56,44.26 52.64,45.18 51.27,45.18 U$10.30
  Bottom 0.152: 43.8,32.83 43.8,32.61 U$14.6 43.8,32.83 | 43.8,32.83 43.8,33.75 44.57,34.51 46.39,34.51 49.14,37.25 49.14,37.86 53.56,42.28 v53.56,43.96
LORA2_SCK  (via drill 0.3)
  Top 0.152: U$10.26 51.27,43.2 52.34,43.2 52.64,42.89 53.25,42.89 56.19,45.83 56.19,50.01 51.73,54.47 v47.46,54.47
  Bottom 0.152: v47.46,54.47 45.43,56.5 U$14.24
LORA2_SSEL  (via drill 0.3)
  Top 0.152: v55.23,44.11 53.71,42.59 52.49,42.59 52.34,42.74 51.27,42.74 U$10.25
  Bottom 0.152: v55.23,44.11 53.1,46.24 50.66,46.24 46.7,50.21 46.7,52.34 48.68,54.32 48.68,56.54 U$14.25
LORA2_TXEN  (via drill 0.3)
  Top 0.152: v53.86,44.72 52.84,45.74 U$10.31
  Bottom 0.152: v53.86,44.72 53.86,44.41 54.17,44.11 54.17,42.46 49.75,38.04 49.75,37.4 46.39,34.05 45.33,34.05 45.18,33.9 45.18,33.14 44.72,32.68 44.72,31.16 44.26,30.7 41.82,30.7 41.21,31.31 41.21,32.53 U$14.7 41.21,32.46
N$1
  Bottom 0.152: J1.A5 9.9,9.25 9.8,9.25 9.15,8.6 9.15,6.95 11.55,4.55 15,4.55 R2.2
N$2
  Bottom 0.152: J1.B5 8.55,11.9 9.05,12.4 9.05,17.6 7.7,18.95 R1.2
N$3  (via drill 0.3)
  Top 0.152: v82.58,11.65 82.76,10.97 U2.12 | v87.13,10.03 88.5,10.4 R3.2
  Bottom 0.152: v82.58,11.65 82.9,11.46 84.1,11.78 v87.13,10.03
N$4
  Top 0.152: U2.16 81.16,9.44 80.94,9.56 76.84,8.47 R4.2
N$5
  Top 0.152: U2.1 81.33,8.48 80.58,7.18 80.85,6.15 R5.1
N$6  (via drill 0.3)
  Top 0.152: 86.14,16.81 U$2.1 86.08,16.7 v85.51,15.73 85.54,15.7 | 86.57,16.56 U$2.2 86.29,15.98 86,15.7 85.54,15.7 | 87,16.31 U$2.3 86.6,15.54 85.7,15.54 85.54,15.7 | v81.93,14.77 80.56,14.4 U$4.1
  Bottom 0.152: v81.93,14.77 84.55,14.77 v85.51,15.73
N$7
  Top 0.152: 91.78,16.59 91.87,16.25 C12.1 92.05,16.33 92.05,17.4 90.45,19 89.24,19 89.12,18.88 U$2.9 88.75,18.34
N$8
  Top 0.152: U$2.4 87.37,15.95 86.75,14.87 86.89,14.36 86.14,13.06 84.77,12.7 R6.2
N$11
  Top 0.152: C14.2 41.23,49.7 41.67,49.26 41.67,47.77 44.18,45.26 U$10.7
N$12
  Bottom 0.152: F1.P$2 80.35,17.88 82.97,20.5 85.47,20.5 86.85,21.88 P1.1
N$13
  Top 0.152: T1.2 39.84,34.36 39.99,34.36 40.3,34.66 40.3,37.1 40.45,37.25 R9.1
N$14
  Top 0.152: T3.3 75.89,17.82 75.08,16.41 74.4,16.23 72.34,12.66 72.84,10.78 R8.1
N$16  (via drill 0.3)
  Top 0.152: v44.41,35.88 42.89,34.36 41.52,34.36 T1.5 | v48.22,37.56 49.9,37.56 50.05,37.41 R10.1
  Bottom 0.152: v44.41,35.88 46.55,35.88 v48.22,37.56
N$17  (via drill 0.3)
  Top 0.152: v77.2,18.08 77.85,17.7 T3.5 | v78.51,20.35 79.07,21.33 R12.1
  Bottom 0.152: v78.51,20.35 v77.2,18.08
N$18
  Top 0.152: T2.2 41.52,30.85 41.82,30.85 43.8,32.83 43.8,34.51 45.02,35.73 45.02,37.25 R11.1
PWR_TRIG
  Top 0.152: 76.26,18.66 T3.2 76.06,18.82 76.06,19.09 76.05,19.11 76.06,19.12 76.06,19.28 76.06,19.38 76.06,19.81 75.8,20.06 75.78,20.06 64.53,31.31 51.27,31.31 49.59,29.63 48.38,29.63 48.22,29.79 48.22,30.7 J2.4 J2.3
SWCLK  (via drill 0.3)
  Top 0.152: v50.51,49.75 50.66,49.6 50.66,48.99 U$10.37
  Bottom 0.152: v50.51,49.75 50.81,49.75 54.17,53.1 55.39,53.1 70.47,38.01 70.78,38.01 71.39,37.41 71.39,36.28 JP1.3
SWDIO  (via drill 0.3)
  Top 0.152: U$10.34 52.14,47.25 v52.27,47.12
  Bottom 0.152: v52.27,47.12 50.56,48.84 50.2,48.84 49.59,49.44 49.59,50.05 53.86,54.32 55.23,54.32 59.2,50.36 59.65,50.36 73.67,36.34 73.67,33.69 JP1.2
USB_D+  (via drill 0.3)
  Top 0.152: v13.95,11.25 15.15,12.45 15.5,12.45 U$3.2
  Bottom 0.152: 10.05,10.95 10.05,10.65 9.6,10.2 9.45,10.2 J1.A6 | 10.05,10.95 9.7,11.3 9.2,11.3 8.95,11.05 J1.B6 | v13.95,11.25 13.7,11 10.1,11 10.05,10.95
USB_D-  (via drill 0.3)
  Top 0.152: v14.65,13.8 14.25,14.2 14.25,14.65 U$3.3
  Bottom 0.152: J1.A7 9.15,10.55 9.05,10.55 8.6,10.1 8.6,9.8 8.95,9.45 9.2,9.45 9.45,9.7 9.65,9.7 J1.B7 9.75,9.75 9.95,9.75 10.85,10.65 14.15,10.65 14.65,11.15 v14.65,13.8
USB_DM  (via drill 0.3)
  Top 0.152: v54.93,45.33 54.01,46.24 51.27,46.24 U$10.32 | v56,44.26 56,44.11 53.86,41.98 v51.58,41.98 | v45.48,40.45 43.19,40.45 41.97,39.23 41.97,36.49 40.91,35.42 40.91,33.29 40.27,32.66 38.45,32.66 29.17,23.38 U$11.2
  Bottom 0.152: v56,44.26 v54.93,45.33 | v51.58,41.98 50.05,40.45 v45.48,40.45
USB_DP  (via drill 0.3, 0.35)
  Top 0.152: 30.39,21.1 U$11.3 | v54.93,46.09 54.47,46.55 52.03,46.55 51.88,46.7 51.27,46.7 U$10.33 | U$11.3 30.54,20.95 29.43,20.95 v28.42,19.93 | U$11.3 29.58,21.09
  Bottom 0.152: v54.93,46.09 60.87,40.15 60.87,39.54 38.32,16.98 33.59,16.98 30.65,19.93 v28.42,19.93
USB_GND  (via drill 0.3)
  Top 0.152: 7.35,4.3 J1.S3 J1.S1 11,6.3 | 6.65,13.8 J1.S2 | U$3.4 v8.4,14.16
  Bottom 0.152: 11,6.35 J1.S1 | 11,7.45 J1.A1 | 7.6,13.3 7.1,13.8 6.7,13.8 J1.S2 | 7.6,13.3 J1.A12 | 7.6,13.3 J1.A12 | 7.6,13.25 J1.A12 | 7.6,13.25 J1.A12 | J1.A12 7.68,13.33 J1.A12 | R1.1 J1.S2 | J1.S2 J1.S4 J1.S3 | v8.4,14.16 8.46,13.59 J1.B1 7.6,13.2 7.6,13.25 | J1.S1 10.98,7.59 J1.B12 | J1.S1 15.79,6.35 R2.1
  pour Top: 0,15 7.17,27.41 11.31,24.95 22.93,4.82 22.93,0 8.66,0
  pour Bottom: 0,15 7.17,27.41 11.31,24.95 22.93,4.82 22.93,0 8.66,0
USB_V  (via drill 0.3)
  Top 0.152: v15.2,9.1 16.35,10.25 16.75,10.25 U$3.1
  Bottom 0.152: J1.A9 8.05,12.55 8.15,12.45 8.15,12.35 J1.B4 8.1,12.3 7.75,11.95 7.7,11.95 7.6,11.85 7.6,8.05 12.35,3.3 16.1,3.3 17.85,5.05 17.85,6.44 v15.2,9.1 | J1.B9 10.45,8.4 10.45,8.3 10.55,8.2 J1.A4 10.65,8.2 10.85,8.2 11.75,9.1 v15.2,9.1 | 15.25,9.05 v15.2,9.1
V+  (via drill 0.3)
  Top 0.152: 86.77,18.9 U$2.13 86.21,19.19 v86.09,19.73 86.39,20.03 88.2,20.03 | 88.38,18.7 U$2.10 88.69,19.15 88.69,19.55 88.25,19.99 | v79.09,17.85 78.33,18.29 T3.6 | 86.44,24.58 C11.1 87.85,24 88.2,20.4 88.2,20.03 | 87.95,18.95 U$2.11 88.25,19.4 88.25,19.99 | U$2.12 87.81,19.63 88.2,20.03 | 88.25,19.99 88.2,20.03
  Bottom 0.152: v79.09,17.85 79.01,17.75 79.01,15.31 80.53,13.78 84.8,13.78 86.63,15.61 86.63,19.42 86.17,19.88 v86.09,19.73
VBAT+  (via drill 0.3)
  Top 0.152: U2.2 81.82,8.34 82.25,8.09 U2.3 82.19,7.98 v81.82,7.33 | v83.98,6.08 84.62,3.69 C6.1 | 77.52,16.88 T3.4 77.64,16.98 v78.4,16.98
  Bottom 0.152: v83.98,6.08 v81.82,7.33 81.9,7.38 78.4,10.89 v78.4,16.98 78.4,17.29 78.25,17.44 78.25,18.51 79.92,20.18 80.23,20.18 F1.P$1
VBAT_EN
  Top 0.152: 79.92,22.93 R12.2 79.92,23.08 75.2,23.08 66.36,31.92 53.1,31.92 47.14,37.88 47.14,41.98 47.13,42.01 U$10.17
VBAT_REF  (via drill 0.3)
  Top 0.152: R8.2 72.01,9.09 73.38,9.46 74.69,11.73 74.32,13.1 R7.1 | 71.85,9.12 R8.2 | v49.44,34.81 46.63,37.63 46.63,41.98 U$10.16 | v46.52,27.41 53.49,27.41 71.85,9.06 R8.2
  Bottom 0.152: v46.52,27.41 47.07,27.41 50.2,30.55 50.2,34.05 v49.44,34.81
VOUT  (via drill 0.3)
  Top 0.152: v84.61,8.17 84.44,8.12 83.9,8.44 U2.6 | v84.93,6.97 86.12,6.29 C5.1 | 83.2,10.72 83.63,10.47 U2.10 | 83.2,10.72 83.48,11.21 83.91,11.21 v84,11.12 81.74,13.38 80.74,13.38 80.66,13.36 79.45,14.05 79.4,14.23 80.03,15.32 80.03,16.73 79.62,18.27 77.67,19.39 76.81,19.16 T3.1 76.57,19.27 76.57,19.73 64.68,31.61 51.12,31.61 | 83.2,10.72 U2.11 | 51.12,31.61 50.36,30.85 48.68,30.85 J2.2 | 51.12,31.61 51.12,33.44 50.36,34.2 48.68,34.2 J2.1
  Bottom 0.152: v84.93,6.97 v84.61,8.17 84.74,8.38 v84,11.12
VUSB  (via drill 0.35)
  Top 0.152: U2.13 81.91,10.74 79.2,12.3 79.16,12.47 C7.1 | v63.27,28.3 45.22,28.3 35.88,18.96 31.76,18.96 U$11.4 | 79.01,12.56 C7.1 | C7.1 77.53,14.13 v77.53,15.06
  Bottom 0.152: v63.27,28.3 75.5,16.07 76.52,16.07 v77.53,15.06

### Text on the board
bNames: CLK | VCC | GND | DIO | LORA1